# Altium schematic sheet EIS_Main_Interface.SchDoc: Optionale Schnittstellen
size A4; Organization: Hahn-Schickard; Address1: Wilhelm-Schickard-Str. 10; Address2: 78052 Villingen-Schwenningen; Address3: Bernd.Ehrbrecht@Hahn-Schickard.de; DocumentNumber: 1; Revision: 1.0; SheetNumber: 6; SheetTotal: 7; PhoneNumber: 0 7721 943 137; E-Mail: Xxxx.Xxxx@Hahn-Schickard.de; ProjectName: Project File Name
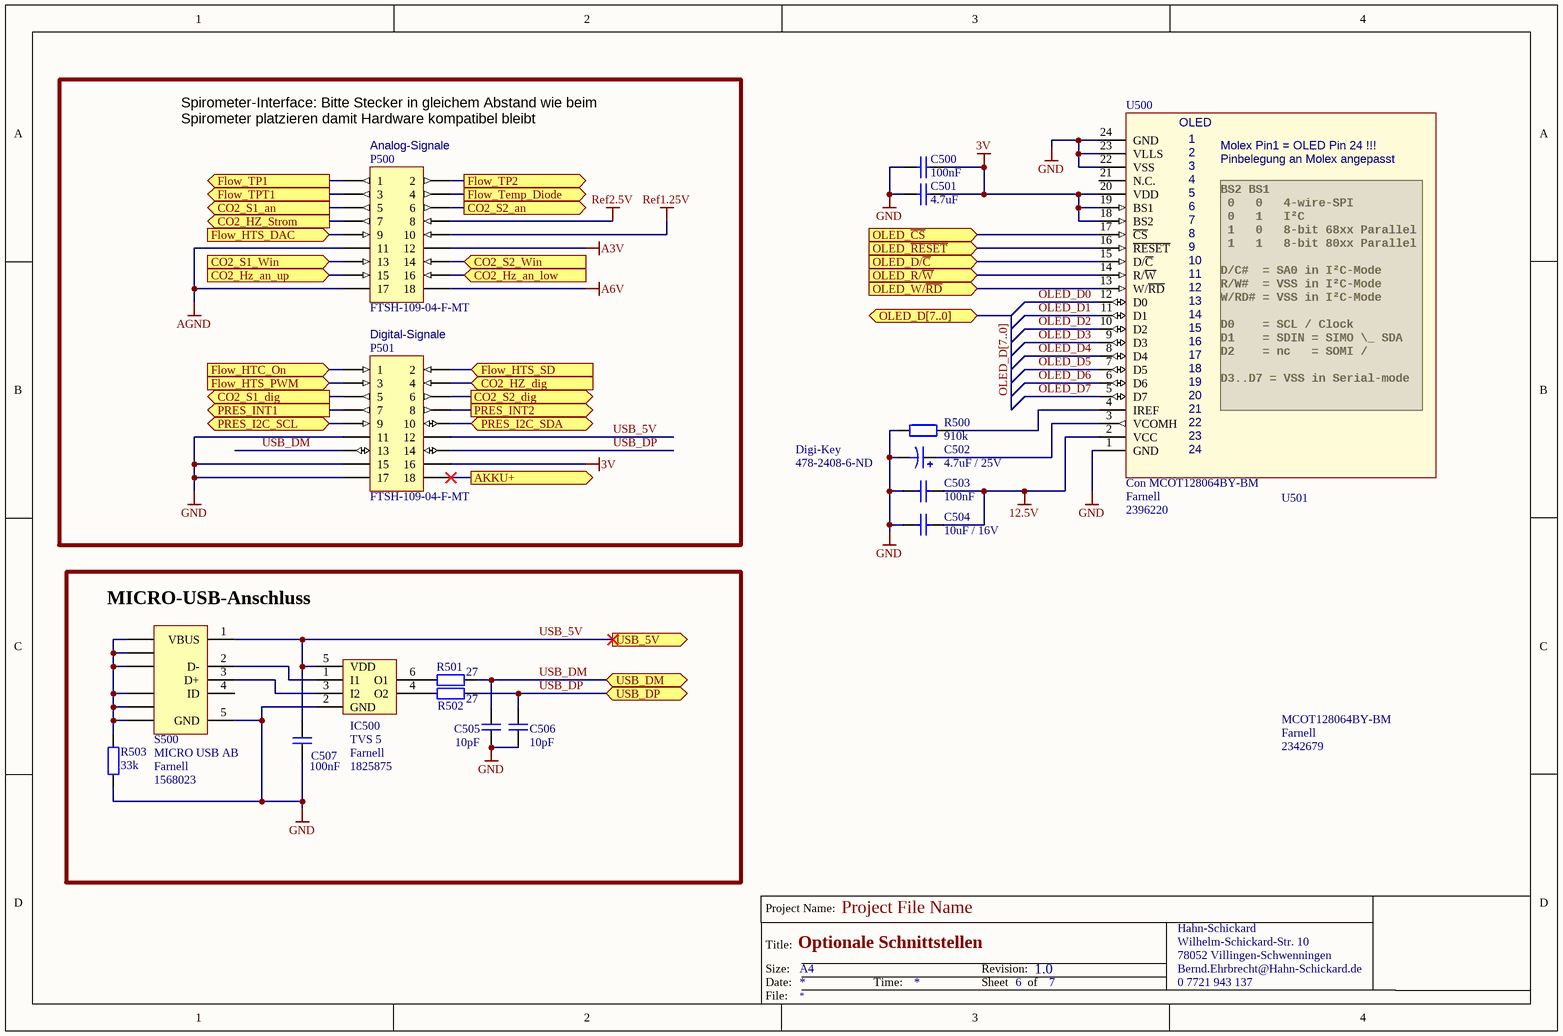
[diagram p0: EIS_Main_Interface.SchDoc]

## Parts
C500  100nF  [CAPC1608N]
C501  4.7uF  [CAPC2012N]
C502  4.7uF / 25V  Supplier 1: Digi-Key  Supplier Part Number 1: 478-2408-6-ND  [C1210]
C503  100nF  [CAPC1608N]
C504  10uF / 16V  [CAPC2012N]
C505  10pF  [CAPC1608N]
C506  10pF  [CAPC1608N]
C507  100nF  [CAPC1608N]
IC500  TVS 5  Supplier 1: Farnell  Supplier Part Number 1: 1825875  [SOT23-6]
P500  FTSH-109-04-F-MT  [FTSH-109-01-X-MT-spezial]
P501  FTSH-109-04-F-MT  [FTSH-109-01-X-MT-spezial]
R500  910k  [RESC1608N]
R501  27  [RESC1608N]
R502  27  [RESC1608N]
R503  33k  [RESC1608N]
S500  MICRO USB AB  Supplier 1: Farnell  Supplier Part Number 1: 1568023  [MICRO USB AB REC]
U500  Con MCOT128064BY-BM  Supplier 1: Farnell  Supplier Part Number 1: 2396220  [Molex-52435-2471]
U501  MCOT128064BY-BM  Supplier 1: Farnell  Supplier Part Number 1: 2342679  (mechanical)

## Ports
AKKU+ (out), CO2_Hz_an_low (in), CO2_Hz_an_up (in), CO2_HZ_dig (in), CO2_HZ_Strom (out), CO2_S1_an (out), CO2_S1_dig (out), CO2_S1_Win (in), CO2_S2_an (out), CO2_S2_dig (out), CO2_S2_Win (in), Flow_HTC_On (in), Flow_HTS_DAC (in), Flow_HTS_PWM (in), Flow_HTS_SD (in), Flow_Temp_Diode (out), Flow_TP1 (out), Flow_TP2 (out), Flow_TPT1 (out), OLED_D/~{C} (in), OLED_D[7..0] (bidir), OLED_R/~{W} (in), OLED_W/~{RD} (in), OLED_~{CS} (in), OLED_~{RESET} (in), PRES_I2C_SCL (bidir), PRES_I2C_SDA (bidir), PRES_INT1 (out), PRES_INT2 (out), USB_5V (out), USB_DM (bidir), USB_DP (bidir)

## Nets
3V: C500.2 C501.2 P501.16 U500.18(BS2) U500.19(BS1) U500.20(VDD)
12.5V: C503.1 C504.1 U500.2(VCC)
A3V: P500.12
A6V: P500.18
AGND: P500.11 P500.17
GND: C500.1 C501.1 C502.2 C503.2 C504.2 C505.2 C506.2 C507.2 IC500.2(GND) P501.11 P501.15 P501.17 R500.2 R503.1 S500.5(GND) U500.1(GND) U500.22(VSS) U500.23(VLLS) U500.24(GND)
Ref1.25V: P500.10
Ref2.5V: P500.8
AKKU+: P501.18 ; port AKKU+
CO2_Hz_an_low: P500.16 ; port CO2_Hz_an_low
CO2_Hz_an_up: P500.15 ; port CO2_Hz_an_up
CO2_HZ_dig: P501.4 ; port CO2_HZ_dig
CO2_HZ_Strom: P500.7 ; port CO2_HZ_Strom
CO2_S1_an: P500.5 ; port CO2_S1_an
CO2_S1_dig: P501.5 ; port CO2_S1_dig
CO2_S1_Win: P500.13 ; port CO2_S1_Win
CO2_S2_an: P500.6 ; port CO2_S2_an
CO2_S2_dig: P501.6 ; port CO2_S2_dig
CO2_S2_Win: P500.14 ; port CO2_S2_Win
Flow_HTC_On: P501.1 ; port Flow_HTC_On
Flow_HTS_DAC: P500.9 ; port Flow_HTS_DAC
Flow_HTS_PWM: P501.3 ; port Flow_HTS_PWM
Flow_HTS_SD: P501.2 ; port Flow_HTS_SD
Flow_Temp_Diode: P500.4 ; port Flow_Temp_Diode
Flow_TP1: P500.1 ; port Flow_TP1
Flow_TP2: P500.2 ; port Flow_TP2
Flow_TPT1: P500.3 ; port Flow_TPT1
OLED_~{CS}: U500.17(~{CS}) ; port OLED_~{CS}
OLED_D0: U500.12(D0)
OLED_D1: U500.11(D1)
OLED_D2: U500.10(D2)
OLED_D3: U500.9(D3)
OLED_D4: U500.8(D4)
OLED_D5: U500.7(D5)
OLED_D6: U500.6(D6)
OLED_D7: U500.5(D7)
OLED_D/~{C}: U500.15(D/~{C}) ; port OLED_D/~{C}
OLED_R/~{W}: U500.14(R/~{W}) ; port OLED_R/~{W}
OLED_~{RESET}: U500.16(~{RESET}) ; port OLED_~{RESET}
OLED_W/~{RD}: U500.13(W/~{RD}) ; port OLED_W/~{RD}
PRES_I2C_SCL: P501.9 ; port PRES_I2C_SCL
PRES_I2C_SDA: P501.10 ; port PRES_I2C_SDA
PRES_INT1: P501.7 ; port PRES_INT1
PRES_INT2: P501.8 ; port PRES_INT2
USB_5V: C507.1 IC500.5(VDD) P501.12 S500.1(VBUS) ; port USB_5V
USB_DM: C505.1 P501.13 R501.2 ; port USB_DM
USB_DP: C506.1 P501.14 R502.2 ; port USB_DP
NetC502_1: C502.1 U500.3(VCOMH)
NetIC500_1: IC500.1(I1) S500.2(D-)
NetIC500_3: IC500.3(I2) S500.3(D+)
NetIC500_4: IC500.4(O2) R502.1
NetIC500_6: IC500.6(O1) R501.1
NetR500_1: R500.1 U500.4(IREF)
NetR503_2: R503.2 S500.GND1(SHLD) S500.GND2(SHLD) S500.GND3(SHLD) S500.GND4(SHLD) S500.GND5(SHLD) S500.GND6(SHLD)

Not connected (* = marked no-connect by the designer): S500 4(ID); U500 21(N.C.)

## Buses and harness runs
bus OLED_D[7..0] = port OLED_D[7..0]

## Notes on the sheet
- (near P500) Spirometer-Interface: Bitte Stecker in gleichem Abstand wie beim Spirometer platzieren damit Hardware kompatibel bleibt
- (near P500) Analog-Signale
- Digital-Signale
- (near S500) MICRO-USB-Anschluss
- Project Name:
- Size:
- Date:
- Title:
- A4
- Time:
- Revision:
- Sheet
- of
- File:
- (in symbol Con MCOT128064BY-BM) OLED; Molex Pin1 = OLED Pin 24 !!!; Pinbelegung an Molex angepasst; BS2 BS1 / 0   0   4-wire-SPI / 0   1   I²C / 1   0   8-bit 68xx Parallel / 1   1   8-bit 80xx Parallel / D/C#  = SA0 in I²C-Mode / R/W#  = VSS in I²C-Mode / W/RD# = VSS in I²C-Mode / D0    = SCL / Clock / D1    = SDIN = SIMO \_ SDA / D2    = nc   = SOMI / / D3..D7 = VSS in Serial-mode

## Library data of the parts
C500 C503 = C0805: Ceramic Chip Capacitor - Standard; Note: Footprint corresponds to dimensions for bulk cassette packaging. This case size has tightened tolerances.; 07_Lieferant: Digi-Key; 08_Lieferanten_Nummer: 399-1096-1-ND; Published: 17-Jul-2002; LatestRevisionDate: 19-Mar-2004; LatestRevisionNote: Silkscreen size reduced.; DatasheetDocument: Mar-2001; PackageDocument: Mar-2001; PackageReference: 0805; Publisher: Altium Limited; Code_JEITA: 0805; Code_IPC: 2012[0805]; ComponentLink1Description: Manufacturer Link; ComponentLink1URL: http://www.kemet.com/; ComponentLink2Description: Datasheet; ComponentLink2URL: http://www.kemet.com/kemet/web/homepage/kechome.nsf/vapubfilesname/F3102TA.pdf/$file/F3102TA.pdf; Value: 100nF
C501 = C0805: Ceramic Chip Capacitor - Standard; Note: Footprint corresponds to dimensions for bulk cassette packaging. This case size has tightened tolerances.; 07_Lieferant: Digi-Key; 08_Lieferanten_Nummer: 490-6475-1-ND; Published: 17-Jul-2002; LatestRevisionDate: 19-Mar-2004; LatestRevisionNote: Silkscreen size reduced.; DatasheetDocument: Mar-2001; PackageDocument: Mar-2001; PackageReference: 0805; Publisher: Altium Limited; Code_JEITA: 0805; Code_IPC: 2012[0805]; ComponentLink1Description: Manufacturer Link; ComponentLink1URL: http://www.kemet.com/; ComponentLink2Description: Datasheet; ComponentLink2URL: http://www.kemet.com/kemet/web/homepage/kechome.nsf/vapubfilesname/F3102TA.pdf/$file/F3102TA.pdf; Value: 4.7uF
C502 = Cap Pol3: Polarized Capacitor (Surface Mount); Value: 4u7; Published: 8-Jun-2000; LatestRevisionDate: 17-Jul-2002; LatestRevisionNote: Re-released for DXP Platform.; PackageReference: C0805; Publisher: Altium Limited; 07_Lieferant: Digi-Key; 08_Lieferanten_Nummer: 478-2408-6-ND
C504 = C0805: Ceramic Chip Capacitor - Standard; Note: Footprint corresponds to dimensions for bulk cassette packaging. This case size has tightened tolerances.; 07_Lieferant: Digi-Key; 08_Lieferanten_Nummer: 490-6473-1-ND; Published: 17-Jul-2002; LatestRevisionDate: 19-Mar-2004; LatestRevisionNote: Silkscreen size reduced.; DatasheetDocument: Mar-2001; PackageDocument: Mar-2001; PackageReference: 0805; Publisher: Altium Limited; Code_JEITA: 0805; Code_IPC: 2012[0805]; ComponentLink1Description: Manufacturer Link; ComponentLink1URL: http://www.kemet.com/; ComponentLink2Description: Datasheet; ComponentLink2URL: http://www.kemet.com/kemet/web/homepage/kechome.nsf/vapubfilesname/F3102TA.pdf/$file/F3102TA.pdf; Value: 10uF / 16V
C505 C506 = Kondensator SMD Keramik: 07_Lieferant: Digi-Key; 08_Lieferanten_Nummer: 399-1049-1-ND
C507 = Kondensator SMD Keramik: 07_Lieferant: Digi-Key; 08_Lieferanten_Nummer: 399-1096-1-ND
IC500 = WE-TVS 2K 3,3V 23_6L: 07_Lieferant: Farnell; 08_Lieferanten_Nummer: 1825875
P500 = Header 9X2: Header, 9-Pin, Dual row; 07_Lieferant: Samtec; LatestRevisionDate: 17-Jul-2002; LatestRevisionNote: Re-released for DXP Platform.; Publisher: Altium Limited; 08_Lieferanten_Nummer: FTSH-109-04-F-MT
P501 = Header 9X2: 07_Lieferant: Samtec; LatestRevisionDate: 17-Jul-2002; LatestRevisionNote: Re-released for DXP Platform.; Publisher: Altium Limited; 08_Lieferanten_Nummer: FTSH-109-04-F-MT
R500 = Widerstand SMD: 07_Lieferant: Digi-Key; 08_Lieferanten_Nummer: 311-910KHRCT-ND; Value: 910k
R501 R502 = Widerstand SMD: 07_Lieferant: Digi-Key; 08_Lieferanten_Nummer: 311-27GRCT-ND
R503 = Widerstand SMD: 07_Lieferant: Digi-Key; 08_Lieferanten_Nummer: 311-33KGRCT-ND
S500 = MICRO USB AB: Micro USB AB, MOLEX-47589-0001, BOTTOM MOUNT; 07_Lieferant: Farnell; 08_Lieferanten_Nummer: 1568023
U500 = Con MCOT128064BY-BM: Connector für OLED, 128x64Pixel; 35x17mm / blau; 07_Lieferant: Farnell; 08_Lieferanten_Nummer: 2396220
U501 = MCOT128064BY-BM: OLED; blau; 128x64 Pixel;; 07_Lieferant: Farnell; 08_Lieferanten_Nummer: 2342679